# EAGLE design DAI_V1.1 (EAGLE 9.6.2)

## Sheet 1 of 2
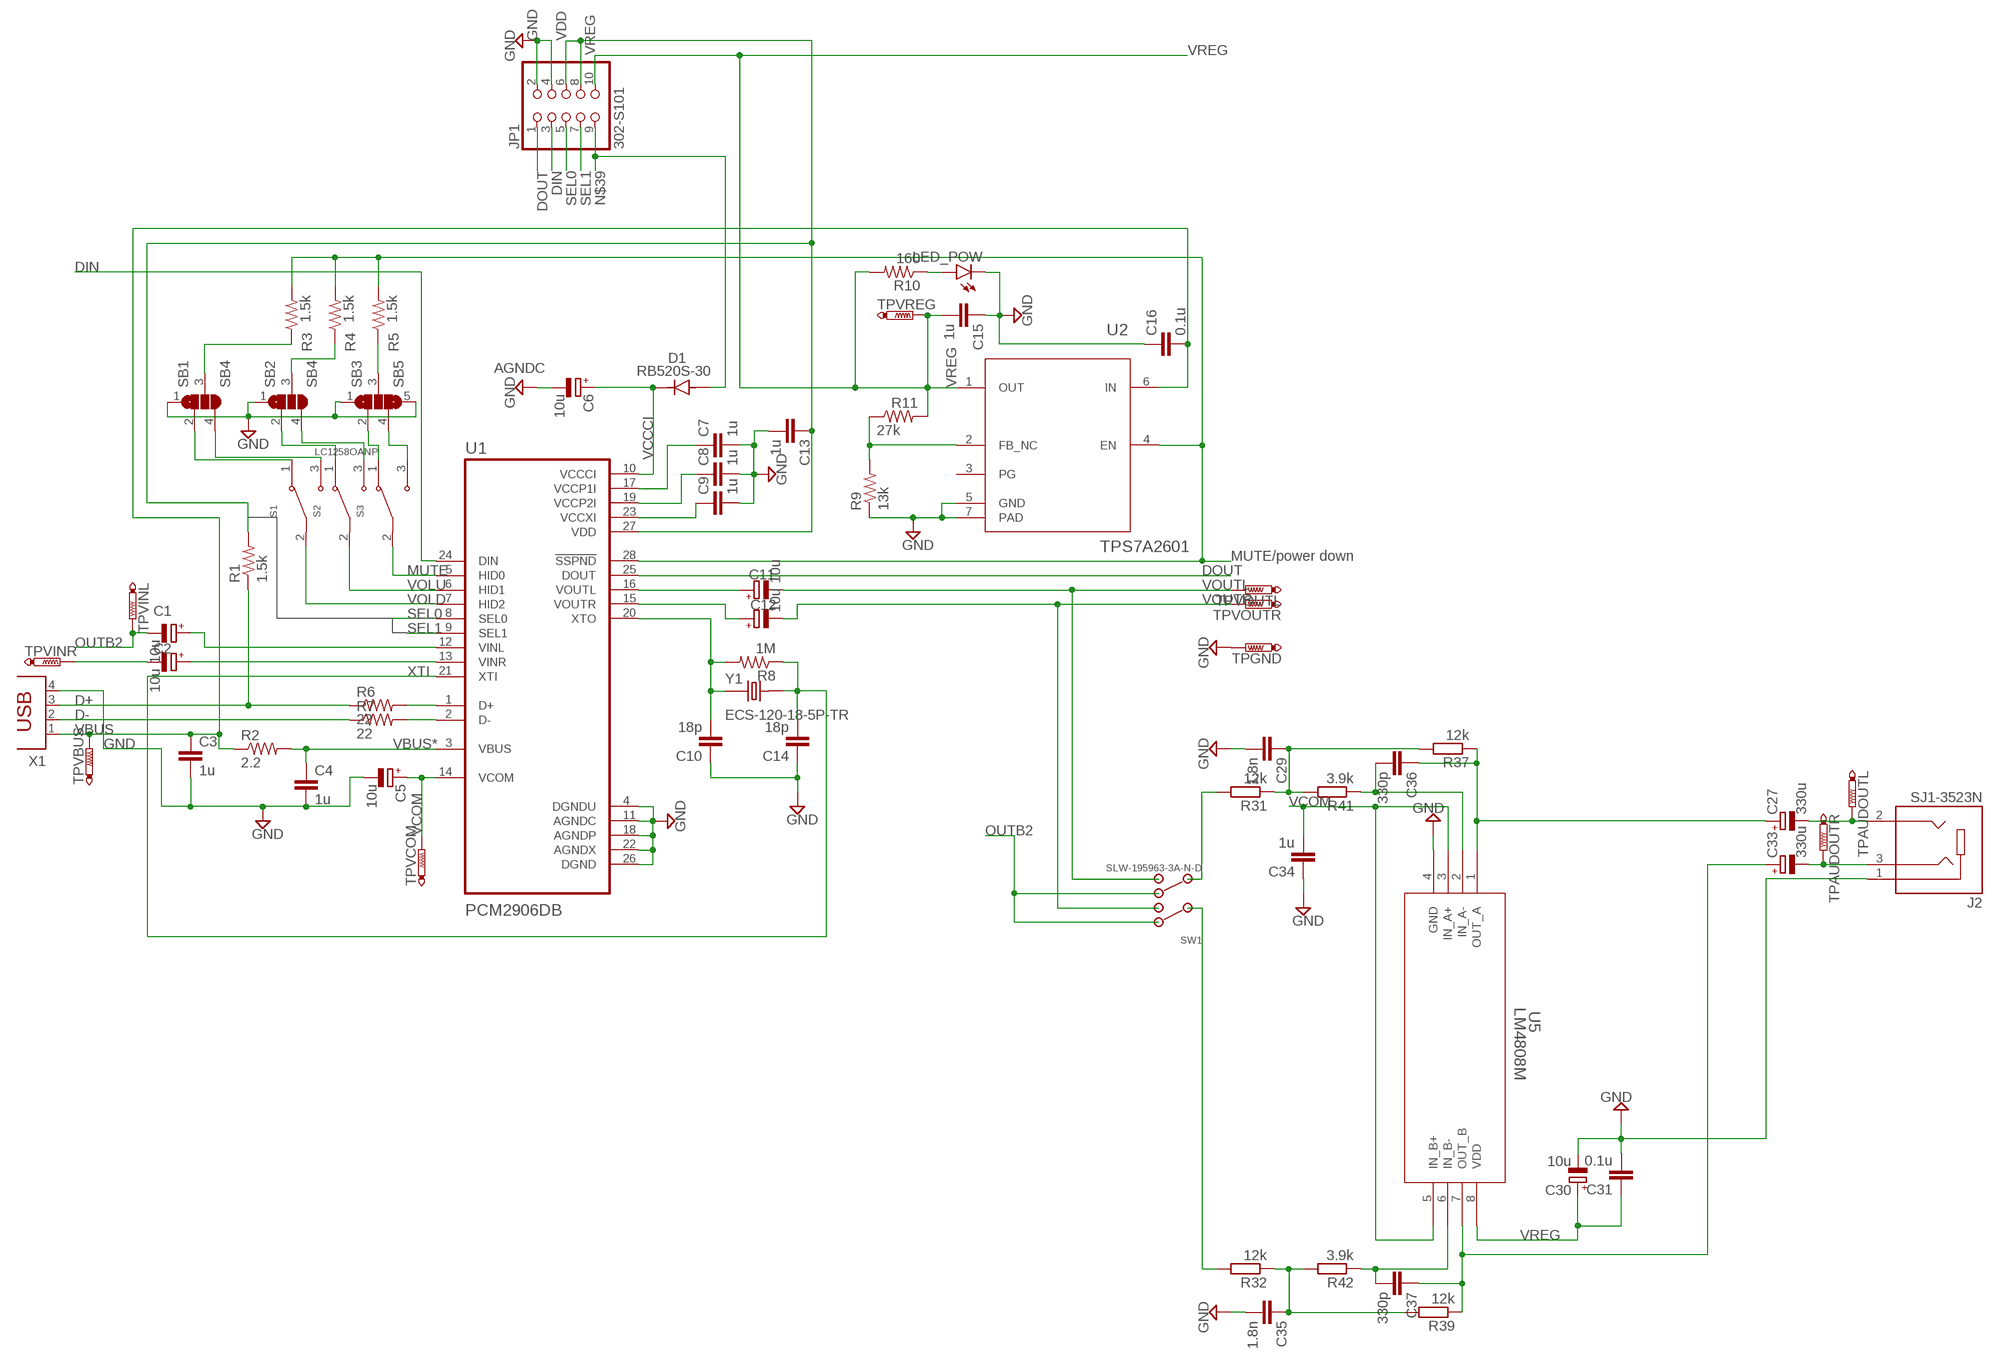
[diagram p0: schematic, sheet 1]

### Parts
C1  10u  CPOL-EUD  [PANASONIC_D]
C2  10u  CPOL-EUD  [PANASONIC_D]
C3  1u  C-EUC0805  [C0805]
C4  1u  C-EUC0805  [C0805]
C5  10u  CPOL-EUB  [PANASONIC_B]
C6  10u  CPOL-EUB  [PANASONIC_B]
C7  1u  C-EUC0805  [C0805]
C8  1u  C-EUC0805  [C0805]
C9  1u  C-EUC0805  [C0805]
C10  18p  C-EUC0805  [C0805]
C11  10u  CPOL-EUD  [PANASONIC_D]
C12  10u  CPOL-EUD  [PANASONIC_D]
C13  1u  C-EUC0805  [C0805]
C14  18p  C-EUC0805  [C0805]
C15  1u  C-EUC0805  [C0805]
C16  0.1u  C-EUC0805  [C0805]
C27  330u  CPOL-EUE3.5-10  [E3,5-10]
C29  1.8n  C-EUC1206  [C1206]
C30  10u  CPOL-EUB  [PANASONIC_B]
C31  0.1u  C-EUC0805  [C0805]
C33  330u  CPOL-EUE3.5-10  [E3,5-10]
C34  1u  C-EUC0805  [C0805]
C35  1.8n  C-EUC1206  [C1206]
C36  330p  C-EUC1206  [C1206]
C37  330p  C-EUC1206  [C1206]
D1  RB520S-30  [DIO_RB520S-30]
J2  SJ1-3523N  [CUI_SJ1-3523N]
JP1  302-S101  PINHD-2X5  [2X05]
LED_POW  LED5MM  [LED5MM]
R1  1.5k  R-US_R0805  [R0805]
R2  2.2  R-US_R0805  [R0805]
R3  1.5k  R-US_R0805  [R0805]
R4  1.5k  R-US_R0805  [R0805]
R5  1.5k  R-US_R0805  [R0805]
R6  22  R-US_R0805  [R0805]
R7  22  R-US_R0805  [R0805]
R8  1M  R-US_R0805  [R0805]
R9  13k  R-US_R0805  [R0805]
R10  160  R-US_R0805  [R0805]
R11  27k  R-US_R0805  [R0805]
R31  12k  R-EU_M1206  [M1206]
R32  12k  R-EU_M1206  [M1206]
R37  12k  R-EU_M1206  [M1206]
R39  12k  R-EU_M1206  [M1206]
R41  3.9k  R-EU_M1206  [M1206]
R42  3.9k  R-EU_M1206  [M1206]
S1  LC1258EENP  [SW_LC1258EENP]
S2  LC1258OANP  LC1258EENP  [SW_LC1258EENP]
S3  LC1258EENP  [SW_LC1258EENP]
SB1  SB4  [SB4]
SB2  SB4  [SB4]
SB3  SB5  [SB5]
SW1  SLW-195963-3A-N-D  SW-T3-4B-A-A3-S2  [SW-T3-4B-A-A3-S2]
TPAUDOUTL  PTR1PAD1-13  [P1-13]
TPAUDOUTR  PTR1PAD1-13  [P1-13]
TPGND  PTR1PAD1-13  [P1-13]
TPVBUS  PTR1PAD1-13  [P1-13]
TPVCOM  PTR1PAD1-13  [P1-13]
TPVINL  PTR1PAD1-13  [P1-13]
TPVINR  PTR1PAD1-13  [P1-13]
TPVOUTL  PTR1PAD1-13  [P1-13]
TPVOUTR  PTR1PAD1-13  [P1-13]
TPVREG  PTR1PAD1-13  [P1-13]
U1  PCM2906DB  [SOP65P780X200-28N]
U2  TPS7A2601  TPS7A2601DRVRDRV0006A_NV  [DRV0006A_NV]
U5  LM4808M  LM4808M/NOPB  [M08A]
X1  PN61729  [PN61729]
Y1  ECS-120-18-5P-TR  [XTAL_ECS-120-18-5P-TR]

### Nets
AUDOUTL: C27.- J2.2 TPAUDOUTL.TP
AUDOUTR: C33.- J2.3 TPAUDOUTR.TP
D+: R1.1 R6.1 X1.3
D-: R7.1 X1.2
DIN: JP1.3 U1.24(DIN)
DOUT: JP1.1 U1.25(DOUT)
GND: C3.2 C4.2 C5.- C6.- C7.2 C8.2 C9.2 C10.1 C13.2 C14.1 C15.1 C16.1 C29.2 C30.- C31.2 C34.1 C35.2 J2.1 JP1.2 JP1.4 LED_POW.K(C) R9.1 SB1.1 SB2.1 SB3.1 SB3.5 TPGND.TP U1.4(DGNDU) U1.11(AGNDC) U1.18(AGNDP) U1.22(AGNDX) U1.26(DGND) U2.5(GND) U2.7(PAD) U5.4(GND) X1.4 ; also sheet 2
MUTE: S3.2(COM) U1.5(HID0)
N$1: R6.2 U1.1(D+)
N$2: R7.2 U1.2(D-)
N$3: R32.2 SW1.2
N$6: R3.1 SB1.3
N$7: C29.1 R31.1 R37.2 R41.2
N$8: R5.1 SB3.3
N$10: LED_POW.A R10.1
N$11: C35.1 R32.1 R39.2 R42.2
N$12: C33.+ C37.1 R39.1 U5.7(OUT_B)
N$13: R4.1 SB2.3
N$14: S1.1(NC) SB1.2
N$15: R9.2 R11.1 U2.2(FB_NC)
N$18: C11.+ U1.16(VOUTL)
N$19: C12.+ U1.15(VOUTR)
N$20: S1.3(NO) SB1.4
N$21: S2.1(NC) SB2.2
N$22: S2.3(NO) SB2.4
N$23: S3.1(NC) SB3.2
N$24: S3.3(NO) SB3.4
N$30: C36.2 R41.1 U5.2(IN_A-)
N$34: R31.2 SW1.5
N$35: C27.+ C36.1 R37.1 U5.1(OUT_A)
N$39: D1.A JP1.9
N$40: C37.2 R42.1 U5.6(IN_B-)
OUTB2: C1.- SW1.1 SW1.4 TPVINL.TP ; also sheet 2
SEL0: JP1.5 U1.8(SEL0)
SEL1: JP1.7 U1.9(SEL1)
SSPND: R3.2 R4.2 R5.2 U1.28(!SSPND) U2.4(EN)
VBUS: C3.1 C16.2 R2.1 TPVBUS.TP U2.6(IN) X1.1
VBUS*: C4.1 R2.2 U1.3(VBUS)
VCCCI: C6.+ D1.C(K) U1.10(VCCCI)
VCCP1I: C7.1 U1.17(VCCP1I)
VCCP2I: C8.1 U1.19(VCCP2I)
VCCXI: C9.1 U1.23(VCCXI)
VCOM: C5.+ C34.2 TPVCOM.TP U1.14(VCOM) U5.3(IN_A+) U5.5(IN_B+) ; also sheet 2
VDD: C13.1 JP1.6 JP1.8 R1.2 U1.27(VDD)
VINL: C1.+ U1.12(VINL)
VINR: C2.- TPVINR.TP
VINR*: C2.+ U1.13(VINR)
VOLD: S1.2(COM) U1.7(HID2)
VOLU: S2.2(COM) U1.6(HID1)
VOUTL: C11.- SW1.6 TPVOUTL.TP
VOUTR: C12.- SW1.3 TPVOUTR.TP
VREG: C15.2 C30.+ C31.1 JP1.10 R10.2 R11.2 TPVREG.TP U2.1(OUT) U5.8(VDD) ; also sheet 2
XTI: C14.2 R8.1 U1.21(XTI) Y1.2
XTO: C10.2 R8.2 U1.20(XTO) Y1.1
Unconnected: U2.3(PG)

### Notes on the sheet
- AGNDC
- MUTE/power down

## Sheet 2 of 2
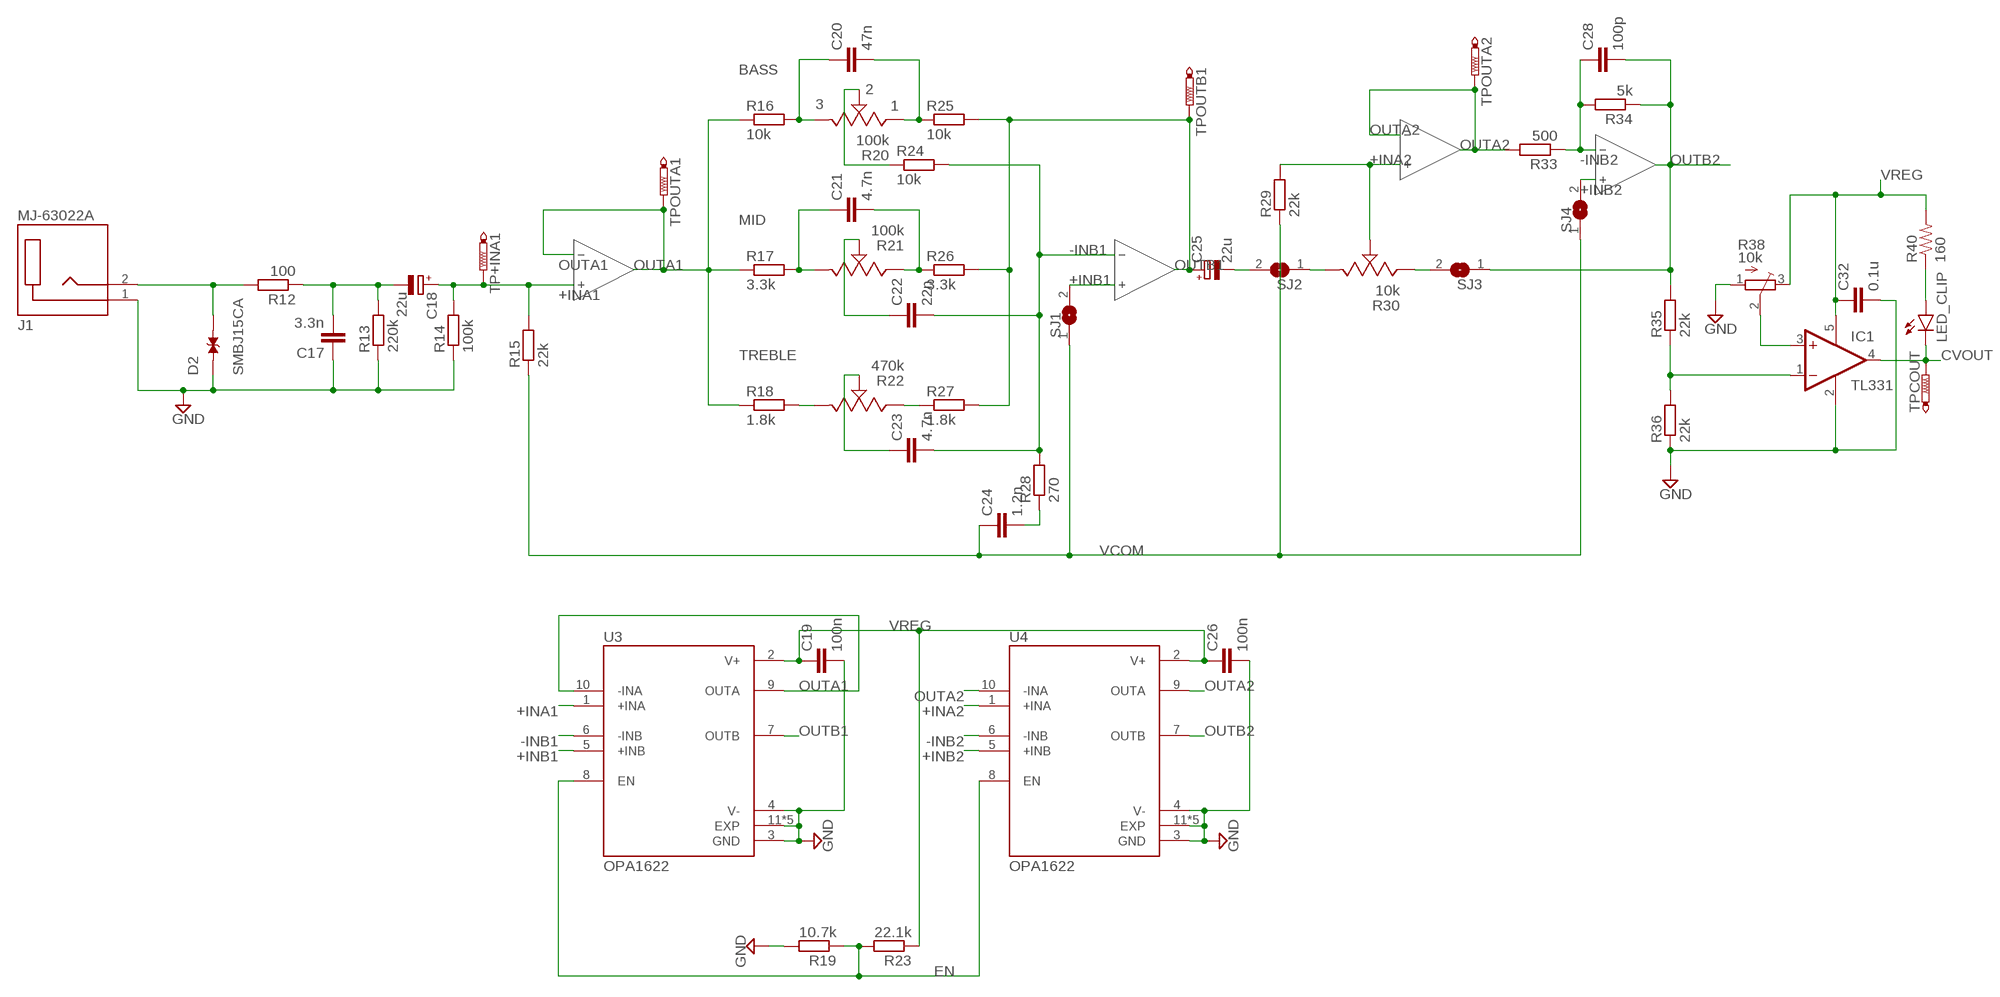
[diagram p1: schematic, sheet 2]

### Parts
C17  3.3n  C-EUC1206  [C1206]
C18  22u  CPOL-EUD  [PANASONIC_D]
C19  100n  C-EUC0805  [C0805]
C20  47n  C-EUC1206  [C1206]
C21  4.7n  C-EUC1206  [C1206]
C22  22n  C-EUC1206  [C1206]
C23  4.7n  C-EUC1206  [C1206]
C24  1.2n  C-EUC1206  [C1206]
C25  22u  CPOL-EUD  [PANASONIC_D]
C26  100n  C-EUC0805  [C0805]
C28  100p  C-EUC1206  [C1206]
C32  0.1u  C-EUC0805  [C0805]
D2  SMBJ15CA  [DIOM4336X265N]
IC1  TL331  [DBV-R-PDSO-G5]
J1  MJ-63022A  [CUI_MJ-63022A]
LED_CLIP  LED5MM  [LED5MM]
R12  100  R-EU_M1206  [M1206]
R13  220k  R-EU_M1206  [M1206]
R14  100k  R-EU_M1206  [M1206]
R15  22k  R-EU_M1206  [M1206]
R16  10k  R-EU_M1206  [M1206]
R17  3.3k  R-EU_M1206  [M1206]
R18  1.8k  R-EU_M1206  [M1206]
R19  10.7k  R-EU_R1206  [R1206]
R20  100k  PTN16-A100125K1B1  [POT_PTN16-A100125K1B1]
R21  100k  PTN16-A100125K1B1  [POT_PTN16-A100125K1B1]
R22  470k  PTN16-A100125K1B1  [POT_PTN16-A100125K1B1]
R23  22.1k  R-EU_R1206  [R1206]
R24  10k  R-EU_M1206  [M1206]
R25  10k  R-EU_M1206  [M1206]
R26  3.3k  R-EU_M1206  [M1206]
R27  1.8k  R-EU_M1206  [M1206]
R28  270  R-EU_M1206  [M1206]
R29  22k  R-EU_M1206  [M1206]
R30  10k  PTN16-A100125K1B1  [POT_PTN16-A100125K1B1]
R33  500  R-EU_M1206  [M1206]
R34  5k  R-EU_M1206  [M1206]
R35  22k  R-EU_M1206  [M1206]
R36  22k  R-EU_M1206  [M1206]
R38  10k  601030  [601030_AVX]
R40  160  R-US_R0805  [R0805]
SJ1  SJW  [SJW]
SJ2  SJW  [SJW]
SJ3  SJW  [SJW]
SJ4  SJW  [SJW]
TP+INA1  PTR1PAD1-13  [P1-13]
TPCOUT  PTR1PAD1-13  [P1-13]
TPOUTA1  PTR1PAD1-13  [P1-13]
TPOUTA2  PTR1PAD1-13  [P1-13]
TPOUTB1  PTR1PAD1-13  [P1-13]
U3  OPA1622  OPA1622IDRCR  [IC_OPA1622IDRCR]
U4  OPA1622  OPA1622IDRCR  [IC_OPA1622IDRCR]

### Nets
+INA1: C18.+ R14.2 R15.2 TP+INA1.TP U3.1(+INA)
+INA2: R29.2 R30.2 U4.1(+INA)
+INB1: SJ1.2 U3.5(+INB)
+INB2: SJ4.2 U4.5(+INB)
-INB1: C22.2 C23.2 R24.2 R28.2 U3.6(-INB)
-INB2: C28.1 R33.1 R34.2 U4.6(-INB)
CVOUT: IC1.4(OUT) LED_CLIP.K(C) TPCOUT.TP
EN: R19.1 R23.2 U3.8(EN) U4.8(EN)
GND: C17.1 C19.2 C26.2 C32.2 D2.1 IC1.2(GND) J1.1(SLEEVE) R13.1 R14.1 R19.2 R36.1 R38.1(A) U3.3(GND) U3.4(V-) U3.11(EXP) U3.12(EXP) U3.13(EXP) U3.14(EXP) U3.15(EXP) U4.3(GND) U4.4(V-) U4.11(EXP) U4.12(EXP) U4.13(EXP) U4.14(EXP) U4.15(EXP) ; also sheet 1
N$4: R18.2 R22.3
N$5: R22.1 R27.1
N$9: C25.- SJ2.2
N$16: D2.2 J1.2(TIP) R12.2
N$17: C17.2 C18.- R12.1 R13.2
N$25: C21.1 R17.2 R21.3
N$26: C21.2 R21.1 R26.1
N$27: R30.3 SJ2.1
N$28: C20.1 R16.2 R20.3
N$29: IC1.1(-IN) R35.1 R36.2
N$31: C20.2 R20.1 R25.1
N$32: R20.2 R24.1
N$33: R30.1 SJ3.2
N$36: C23.1 R22.2
N$37: C22.1 R21.2
N$38: IC1.3(+IN) R38.2(S)
N$42: LED_CLIP.A R40.1
N$45: C24.2 R28.1
OUTA1: R16.1 R17.1 R18.1 TPOUTA1.TP U3.9(OUTA) U3.10(-INA)
OUTA2: R33.2 TPOUTA2.TP U4.9(OUTA) U4.10(-INA)
OUTB1: C25.+ R25.2 R26.2 R27.2 TPOUTB1.TP U3.7(OUTB)
OUTB2: C28.2 R34.1 R35.2 SJ3.1 U4.7(OUTB) ; also sheet 1
VCOM: C24.1 R15.1 R29.1 SJ1.1 SJ4.1 ; also sheet 1
VREG: C19.1 C26.1 C32.1 IC1.5(V+) R23.1 R38.3(E) R40.2 U3.2(V+) U4.2(V+) ; also sheet 1

### Notes on the sheet
- BASS
- 2
- 3 | 1
- MID
- TREBLE

## Library data of the parts
C1 C2 C5 C6 C11 C12 C18 C25 C27 C30 C33 = rcl:CPOL-EU: POLARIZED CAPACITOR, European symbol; SPICEPREFIX: C
C3 C4 C7-C10 C13-C17 C19-C24 C26 C28 C29 C31 C32 C34-C37 = rcl:C-EU: CAPACITOR, European symbol; SPICEPREFIX: C
D1 = RB520S-30:RB520S-30: Check availability <https://pricing.snapeda.com/parts/RB520S-30/Taiwan%20Semiconductor/view-part?ref=eda>; AVAILABILITY: In Stock; CHECK_PRICES: https://www.snapeda.com/parts/RB520S-30/taiwan/view-part/?ref=eda; DESCRIPTION: Diode Small Signal Schottky 30V 0.2A 2-Pin SOD-523F T/R; MF: Taiwan Semiconductor; MP: RB520S-30; PACKAGE: SOD-523F-2 Taiwan Semiconductor; PRICE: None; SNAPEDA_LINK: https://www.snapeda.com/parts/RB520S-30/taiwan/view-part/?ref=snap
D2 = SMBJ15CA:SMBJ15CA: Check availability <https://pricing.snapeda.com/parts/SMBJ15CA/Taiwan%20Semiconductor/view-part?ref=eda>; AVAILABILITY: In Stock; CHECK_PRICES: https://www.snapeda.com/parts/SMBJ15CA/taiwan/view-part/?ref=eda; DESCRIPTION: 600W, 17.6V, 5%, Bidirectional, TVS; MF: Taiwan Semiconductor; MP: SMBJ15CA; PACKAGE: SMB Taiwan Semiconductor; PRICE: None; SNAPEDA_LINK: https://www.snapeda.com/parts/SMBJ15CA/taiwan/view-part/?ref=snap
IC1 = linear:TL331: SINGLE DIFFERENTIAL COMPARATOR Source: Data sheet <http://www.ti.com/lit/ds/symlink/tl331-q1.pdf>
J1 = MJ-63022A:MJ-63022A: Check availability <https://pricing.snapeda.com/parts/MJ-63022A/Same%20Sky/view-part?ref=eda>; AVAILABILITY: In Stock; CHECK_PRICES: https://www.snapeda.com/parts/MJ-63022A/Same+Sky/view-part/?ref=eda; DESCRIPTION: 6.35 mm, Mono, Right Angle, Through Hole Mount, 2 Conductors, 0 Internal Switches, Audio Jack Connector; MF: Same Sky; MP: MJ-63022A; PACKAGE: None; PRICE: None; SNAPEDA_LINK: https://www.snapeda.com/parts/MJ-63022A/Same+Sky/view-part/?ref=snap
J2 = SJ1-3523N:SJ1-3523N: Check availability <https://pricing.snapeda.com/parts/SJ1-3523N/Same%20Sky/view-part?ref=eda>; AVAILABILITY: In Stock; CHECK_PRICES: https://www.snapeda.com/parts/SJ1-3523N/Same+Sky/view-part/?ref=eda; DESCRIPTION: 3.5 mm, Stereo, Right Angle, Through Hole, 3 Conductors, 0 Internal Switches, Audio Jack Connector; MF: Same Sky; MP: SJ1-3523N; PACKAGE: None; PRICE: None; SNAPEDA_LINK: https://www.snapeda.com/parts/SJ1-3523N/Same+Sky/view-part/?ref=snap
JP1 = pinhead:PINHD-2X5: PIN HEADER
LED_CLIP LED_POW = led:LED: LED OSRAM: - CHIPLED LG R971, LG N971, LY N971, LG Q971, LY Q971, LO R971, LY R971 LH N974, LH R974 LS Q976, LO Q976, LY Q976 LO Q996 - Hyper CHIPLED LW Q18S LB Q993, LB Q99A, LB R99A - SideLED LS A670, LO A670, LY A670, LG A670, LP A670 LB A673, LV A673, LT A673, LW A673 LH A674 LY A675 LS A676, LA A676, LO A676, LY A676, LW A676 LS A679, LY A679, LG A679 - Hyper Micro SIDELED® LS Y876, LA Y876, LO Y876, LY Y876 LT Y87S - SmartLED LW L88C, LW L88S LB L89C, LB L89S, LG L890 LS L89K, LO L89K, LY L89K LS L896, LA L896, LO L896, LY L896 - TOPLED LS T670, LO T670, LY T670, LG T670, LP T670 LSG T670, LSP T670, LSY T670, LOP T670, LYG T670 LG T671, LOG T671, LSG T671 LB T673, LV T673, LT T673, LW T673 LH T674 LS T676, LA T676, LO T676, LY T676, LB T676, LH T676, LSB T676, LW T676 LB T67C, LV T67C, LT T67C, LS T67K, LO T67K, LY T67K, LW E67C LS E67B, LA E67B, LO E67B, LY E67B, LB E67C, LV E67C, LT E67C LW T67C LS T679, LY T679, LG T679 LS T770, LO T770, LY T770, LG T770, LP T770 LB T773, LV T773, LT T773, LW T773 LH T774 LS E675, LA E675, LY E675, LS T675 LS T776, LA T776, LO T776, LY T776, LB T776 LHGB T686 LT T68C, LB T68C - Hyper Mini TOPLED® LB M676 - Mini TOPLED Santana® LG M470 LS M47K, LO M47K, LY M47K Source: http://www.osram.convergy.de LUXEON: - LUMILED® LXK2-PW12-R00, LXK2-PW12-S00, LXK2-PW14-U00, LXK2-PW14-V00 LXK2-PM12-R00, LXK2-PM12-S00, LXK2-PM14-U00 LXK2-PE12-Q00, LXK2-PE12-R00, LXK2-PE12-S00, LXK2-PE14-T00, LXK2-PE14-U00 LXK2-PB12-K00, LXK2-PB12-L00, LXK2-PB12-M00, LXK2-PB14-N00, LXK2-PB14-P00, LXK2-PB14-Q00 LXK2-PR12-L00, LXK2-PR12-M00, LXK2-PR14-Q00, LXK2-PR14-R00 LXK2-PD12-Q00, LXK2-PD12-R00, LXK2-PD12-S00 LXK2-PH12-R00, LXK2-PH12-S00 LXK2-PL12-P00, LXK2-PL12-Q00, LXK2-PL12-R00 Source: www.luxeon.com KINGBRIGHT: KA-3528ASYC Source: www.kingbright.com
R1-R11 R40 = rcl:R-US_: RESISTOR, American symbol; SPICEPREFIX: R
R12-R19 R23-R29 R31-R37 R39 R41 R42 = rcl:R-EU_: RESISTOR, European symbol; SPICEPREFIX: R
R20-R22 R30 = PTN16-A100125K1B1:PTN16-A100125K1B1: Check availability <https://pricing.snapeda.com/parts/PTN16-A100125K1B1/Same%20Sky/view-part?ref=eda>; AVAILABILITY: In Stock; CHECK_PRICES: https://www.snapeda.com/parts/PTN16-A100125K1B1/Same+Sky/view-part/?ref=eda; DESCRIPTION: 16.5 mm, Horizontal, Linear, 100 kΩ, Through Hole, Knurled Shaft Single Section Rotary Potentiometer; MF: Same Sky; MP: PTN16-A100125K1B1; PACKAGE: Package; PRICE: None; SNAPEDA_LINK: https://www.snapeda.com/parts/PTN16-A100125K1B1/Same+Sky/view-part/?ref=snap
R38 = 601030:601030; COPYRIGHT: Copyright (C) 2025 Ultra Librarian. All rights reserved.; MANUFACTURER_NAME: KYOCERA AVX; MANUFACTURER_PART_NUMBER: 601030
S1-S3 = LC1258EENP:LC1258EENP: Check availability <https://pricing.snapeda.com/parts/LC1258EENP/E-Switch/view-part?ref=eda>; AVAILABILITY: In Stock; CHECK_PRICES: https://www.snapeda.com/parts/LC1258EENP/E-Switch/view-part/?ref=eda; DESCRIPTION: SWITCH PUSHBUTTON SPDT 0.3A 30V; MF: E-Switch; MP: LC1258EENP; PACKAGE: None; PRICE: None; SNAPEDA_LINK: https://www.snapeda.com/parts/LC1258EENP/E-Switch/view-part/?ref=snap
SB1 SB2 = SB:SB4
SB3 = SB:SB5
SJ1-SJ4 = jumper:SJ: SMD solder JUMPER
SW1 = SW-T3-4B-A-A3-S2:SW-T3-4B-A-A3-S2
TP+INA1 TPAUDOUTL TPAUDOUTR TPCOUT TPGND TPOUTA1 TPOUTA2 TPOUTB1 TPVBUS TPVCOM TPVINL TPVINR TPVOUTL TPVOUTR TPVREG = testpad:PTR1: TEST PIN
U1 = PCM2906DB:PCM2906DB: Check availability <https://pricing.snapeda.com/parts/PCM2906DB/Texas%20Instruments/view-part?ref=eda>; AVAILABILITY: In Stock; CHECK_PRICES: https://www.snapeda.com/parts/PCM2906DB/Texas+Instruments/view-part/?ref=eda; DESCRIPTION: Stereo USB1.1 CODEC with line-out and S/PDIF I/O, Bus-powered (HID Interface + 500mA USB Current) 28-SSOP; MF: Texas Instruments; MP: PCM2906DB; PACKAGE: SSOP-28 Texas Instruments; PRICE: None; SNAPEDA_LINK: https://www.snapeda.com/parts/PCM2906DB/Texas+Instruments/view-part/?ref=snap
U2 = TPS7A2601DRVR:TPS7A2601DRVR; COPYRIGHT: Copyright (C) 2025 Ultra Librarian. All rights reserved.; DATASHEET: https://www.ti.com/lit/gpn/tps7a26; DESCRIPTION: 500-mA, 18-V, ultra-low-IQ, high-accuracy, adjustable low-dropout voltage regulator with power good 6-WSON -40 to 125; MANUFACTURER_NAME: Texas Instruments; MANUFACTURER_PART_NUMBER: TPS7A2601DRVR; REFDES: RefDes; TYPE: TYPE
U3 U4 = OPA1622IDRCR:OPA1622IDRCR: Check availability <https://pricing.snapeda.com/parts/OPA1622IDRCR/Texas%20Instruments/view-part?ref=eda>; AVAILABILITY: In Stock; CHECK_PRICES: https://www.snapeda.com/parts/OPA1622IDRCR/Texas+Instruments/view-part/?ref=eda; DESCRIPTION: SoundPlus™ Audio Operational Amplifier with High Performance, Low THD+N and Bipolar Input; MF: Texas Instruments; MP: OPA1622IDRCR; PACKAGE: VSON-10 Texas Instruments; PRICE: None; SNAPEDA_LINK: https://www.snapeda.com/parts/OPA1622IDRCR/Texas+Instruments/view-part/?ref=snap
U5 = LM4808M:LM4808M/NOPB; COPYRIGHT: Copyright (C) 2025 Ultra Librarian. All rights reserved.; DATASHEET: https://www.ti.com/lit/gpn/lm4808; DESCRIPTION: 105-mW, stereo, analog input headphone amplifier 8-SOIC -40 to 85; MANUFACTURER_NAME: Texas Instruments; MANUFACTURER_PART_NUMBER: LM4808M/NOPB
X1 = con-berg:PN61729: BERG USB connector; OC_FARNELL: unknown; OC_NEWARK: unknown
Y1 = ECS-120-18-5P-TR:ECS-120-18-5P-TR: Check availability <https://pricing.snapeda.com/parts/ECS-120-18-5P-TR/ECS%20International/view-part?ref=eda>; AVAILABILITY: In Stock; CHECK_PRICES: https://www.snapeda.com/parts/ECS-120-18-5P-TR/ECS/view-part/?ref=eda; DESCRIPTION: 12 MHz ±30ppm Crystal 18pF 50 Ohms HC-49/US; MF: ECS International; MP: ECS-120-18-5P-TR; PACKAGE: HC49/US ECS International; PRICE: None; SNAPEDA_LINK: https://www.snapeda.com/parts/ECS-120-18-5P-TR/ECS/view-part/?ref=snap

## Board
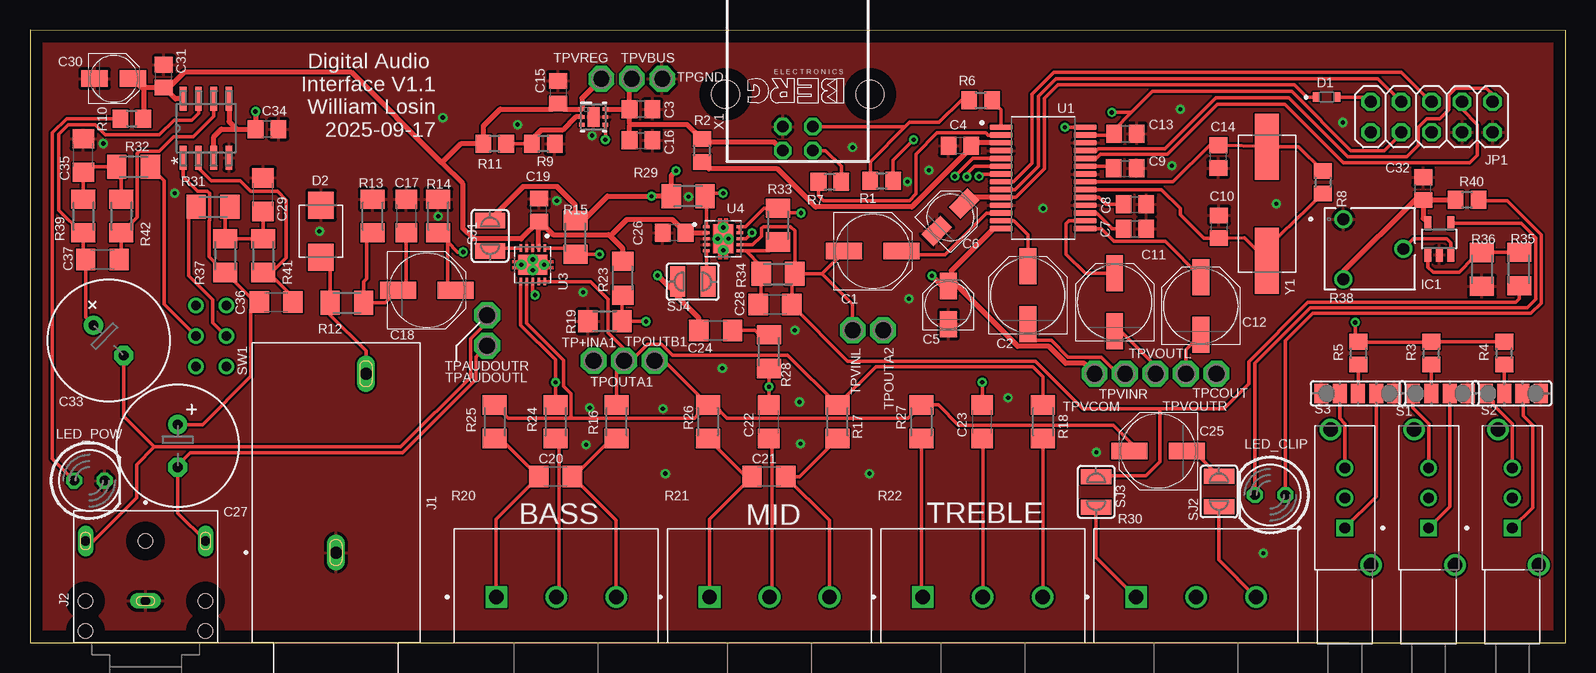
[diagram p2: board, top side]
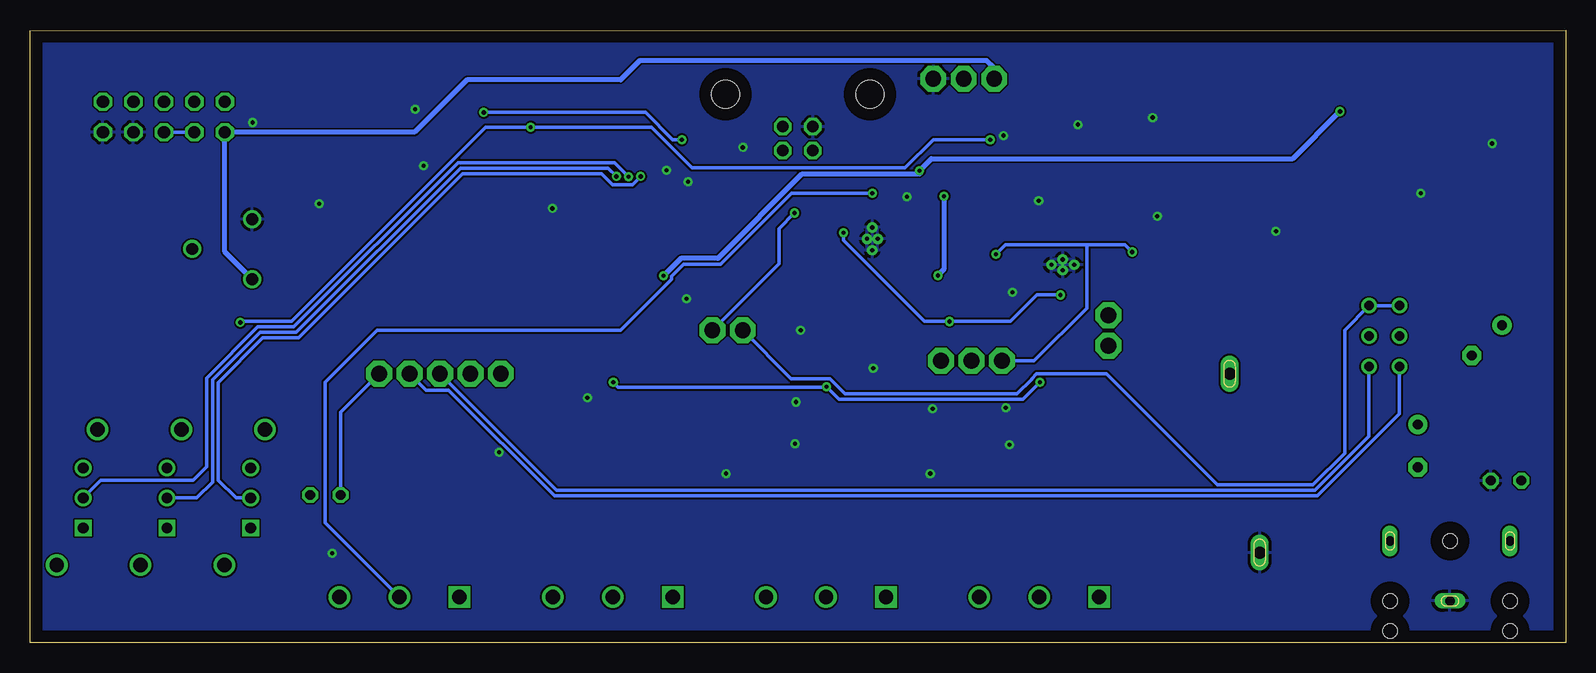
[diagram p3: board, bottom side, seen from below]

Size 128 x 51.06 mm. Coordinates in mm from the lower left corner, seen from the top.
Outline: 0,0 128,0 128,51 0,51.06 0,0
Copper layers (1*16): Top 0.035mm / dielectric 1.5mm / Bottom 0.035mm
Design rules "default": minimum track width 6mil, minimum drill 0.35mm, track to track 6mil, track to pad 6mil, pad to pad 6mil, via to via 6mil, smd to smd 6mil, copper to edge 40mil, drill to drill 6mil, minimum pad ring 10mil, minimum via ring 8mil, stop-mask expansion 4mil, vias tented up to drill 0mil, thermal gap 10mil

### Footprints (pad centres in the part's own frame; a part is rotated, then mirrored left to right if it is on the bottom)
PANASONIC_D = smd 3 x 1.4: + 2.4,0; - -2.4,0
C0805 = smd 1.3 x 1.5: 1 -0.95,0; 2 0.95,0
PANASONIC_B = smd 2.2 x 1.4: + 1.6,0; - -1.6,0
C1206 = smd 1.6 x 1.8: 1 -1.4,0; 2 1.4,0
E3,5-10 = drill 0.813 pad 1.6: + -1.778,0 | drill 0.813 pad 1.6 octagon: - 1.778,0
DIO_RB520S-30 = smd 0.6 x 0.8: A 0.85,0; C -0.85,0
DIOM4336X265N = smd 2.28 x 2.12: 1 -2.165,0; 2 2.165,0
DBV-R-PDSO-G5 = smd 0.6 x 1.2: 1 -0.95,-1.306; 2 0,-1.306; 3 0.95,-1.306; 4 0.95,1.306; 5 -0.95,1.306
CUI_MJ-63022A = drill 1 long: 1 0,0; 2 14.9,-2.5
CUI_SJ1-3523N = drill 0.8 long: 1 0,0; 2 5,5; 3 -5,5 | hole 1.2: -5,-2.5; -5,0; 0,5; 5,-2.5; 5,0
2X05 = drill 1.016 octagon: 1 -5.08,-1.27; 2 -5.08,1.27; 3 -2.54,-1.27; 4 -2.54,1.27; 5 0,-1.27; 6 0,1.27; 7 2.54,-1.27; 8 2.54,1.27; 9 5.08,-1.27; 10 5.08,1.27
LED5MM = drill 0.813 octagon: A -1.27,0; K 1.27,0
R0805 = smd 1.3 x 1.5: 1 -0.95,0; 2 0.95,0
M1206 = smd 1.6 x 2: 1 -1.4,0; 2 1.4,0
R1206 = smd 1.6 x 1.803: 1 -1.422,0; 2 1.422,0
POT_PTN16-A100125K1B1 = drill 1.2 square: 1 0,0 | drill 1.2: 2 5,0; 3 10,0
601030_AVX = drill 0.991 pad 1.499: 1 -2.54,-2.54; 2 -0.051,2.464; 3 2.464,-2.54
SW_LC1258EENP = drill 0.9 square: 1 2.5,0 | drill 0.9: 2 0,0; 3 -2.5,0 | drill 1.2: SH1 5.6,2.2; SH2 -5.7,-1.2
SB4 = smd 1.168 x 1.6: 1 -1.524,0; 2 0,0; 3 1.524,0; 4 3.048,0
SB5 = smd 1.168 x 1.6: 1 -3.048,0; 2 -1.524,0; 3 0,0; 4 1.524,0; 5 3.048,0
SJW = smd 1.27 x 2.54: 1 -1.27,0; 2 1.27,0
SW-T3-4B-A-A3-S2 = drill 0.787: 1 -1.27,-1.27; 2 1.27,-1.27; 3 3.81,-1.27; 4 -1.27,1.27; 5 1.27,1.27; 6 3.81,1.27
P1-13 = drill 1.321 pad 2.159 octagon: TP 0,0
SOP65P780X200-28N = smd 1.9 x 0.48: 1 -3.505,4.225; 2 -3.505,3.575; 3 -3.505,2.925; 4 -3.505,2.275; 5 -3.505,1.625; 6 -3.505,0.975; 7 -3.505,0.325; 8 -3.505,-0.325; 9 -3.505,-0.975; 10 -3.505,-1.625; 11 -3.505,-2.275; 12 -3.505,-2.925; 13 -3.505,-3.575; 14 -3.505,-4.225; 15 3.505,-4.225; 16 3.505,-3.575; 17 3.505,-2.925; 18 3.505,-2.275; 19 3.505,-1.625; 20 3.505,-0.975; 21 3.505,-0.325; 22 3.505,0.325; 23 3.505,0.975; 24 3.505,1.625; 25 3.505,2.275; 26 3.505,2.925; 27 3.505,3.575; 28 3.505,4.225
DRV0006A_NV = smd 0.45 x 0.3: 1 -0.975,0.65; 2 -0.975,0; 3 -0.975,-0.65; 4 0.975,-0.65; 5 0.975,0; 6 0.975,0.65 | smd 1 x 1.6: 7 0,0
IC_OPA1622IDRCR = smd 0.6 x 0.24: 1 -1.4,1; 2 -1.4,0.5; 3 -1.4,0; 4 -1.4,-0.5; 5 -1.4,-1; 6 1.4,-1; 7 1.4,-0.5; 8 1.4,0; 9 1.4,0.5; 10 1.4,1 | smd 1.65 x 2.4: 11 0,0 | drill 0.35: 12 0,0.95; 13 -0.448,0; 14 0.448,0; 15 0,-0.95
M08A = smd 1.981 x 0.559: 1 -2.464,1.905; 2 -2.464,0.635; 3 -2.464,-0.635; 4 -2.464,-1.905; 5 2.464,-1.905; 6 2.464,-0.635; 7 2.464,0.635; 8 2.464,1.905
PN61729 = drill 0.95 octagon: 1 1.25,4.71; 2 -1.25,4.71; 3 -1.25,2.71; 4 1.25,2.71 | hole 2.3: -6.02,0; 6.02,0
XTAL_ECS-120-18-5P-TR = smd 5.5 x 2: 1 -4.75,0; 2 4.75,0

### Placement (x,y rotation side)
C1  70.26,32.64 0 top
C2  83.19,28.96 90 top
C3  50.93,41.86 0 top
C4  77.52,41.43 180 top
C5  76.56,28.14 90 top
C6  76.73,35.46 45 top
C7  92.1,34.49 0 top
C8  92.1,36.53 0 top
C9  91.29,39.52 0 top
C10  99.11,34.67 270 top
C11  90.42,28.37 90 top
C12  97.61,28.07 90 top
C13  91.31,42.42 0 top
C14  99.06,40.51 90 top
C15  44.02,45.87 270 top
C16  50.93,44.45 180 top
C17  31.37,35.56 270 top
C18  33.07,29.39 0 top
C19  42.42,36.07 90 top
C20  43.81,13.84 180 top
C21  61.59,13.84 180 top
C22  61.59,18.41 90 top
C23  79.38,18.41 90 top
C24  57.15,26.04 0 top
C25  94.06,15.98 180 top
C26  53.7,34.16 180 top
C27  12.32,16.41 270 top
C28  62.1,28.19 0 top
C29  19.43,37.34 90 top
C30  6.99,47.02 0 top
C31  11.15,47.22 90 top
C32  116.13,37.85 90 top
C33  6.55,25.2 315 top
C34  19.76,42.8 180 top
C35  4.45,40.61 90 top
C36  20.52,28.4 0 top
C37  6.04,31.95 0 top
D1  108.08,45.47 0 top
D2  24.26,34.29 270 top
IC1  117.47,33.66 0 top
J1  25.5,7.52 90 top
J2  9.63,3.48 0 top
JP1  116.84,43.81 180 top
LED_CLIP  103.38,12.32 180 top
LED_POW  4.95,13.51 0 top
R1  70.99,38.51 0 top
R2  56.01,41.02 270 top
R3  116.81,24.13 90 top
R4  122.89,24.13 90 top
R5  110.74,24.13 90 top
R6  79.25,45.21 0 top
R7  66.67,38.4 180 top
R8  107.77,38.38 270 top
R9  42.8,41.58 180 top
R10  8.48,43.69 0 top
R11  38.73,41.58 180 top
R12  26.42,28.32 180 top
R13  28.57,35.56 270 top
R14  34.04,35.56 270 top
R15  45.47,33.78 270 top
R16  48.9,18.41 270 top
R17  67.31,18.41 270 top
R18  84.45,18.41 270 top
R19  47.93,26.8 180 top
R20  38.86,3.81 0 top
R21  56.64,3.81 0 top
R22  74.42,3.81 0 top
R23  49.4,30.38 270 top
R24  43.81,18.41 90 top
R25  38.73,18.41 90 top
R26  56.52,18.41 90 top
R27  74.3,18.41 90 top
R28  61.59,24.26 270 top
R29  54.86,37.21 0 top
R30  92.2,3.81 0 top
R31  15.27,36.32 180 top
R32  8.64,39.65 0 top
R33  62.36,34.8 90 top
R34  62.36,30.73 180 top
R35  124.13,31.14 270 top
R36  121.03,31.11 90 top
R37  16.26,32.26 90 top
R38  112.01,32.77 270 top
R39  4.45,35.56 90 top
R40  119.79,36.91 180 top
R41  19.43,32.26 90 top
R42  7.62,35.56 90 top
S1  116.59,12.06 270 top
S2  123.57,12.06 270 top
S3  109.6,12.06 270 top
SB1  118.34,20.78 180 top
SB2  124.41,20.78 180 top
SB3  110.69,20.78 180 top
SJ1  38.35,33.91 270 top
SJ2  99.11,12.6 90 top
SJ3  88.87,12.57 270 top
SJ4  55.24,30.1 0 top
SW1  15.11,26.82 270 top
TP+INA1  46.99,23.5 180 top
TPAUDOUTL  38.1,24.77 270 top
TPAUDOUTR  38.1,27.3 90 top
TPCOUT  98.91,22.43 0 top
TPGND  52.7,46.99 180 top
TPOUTA1  49.53,23.5 180 top
TPOUTA2  71.12,26.04 180 top
TPOUTB1  52.07,23.5 180 top
TPVBUS  50.16,46.99 0 top
TPVCOM  88.75,22.43 180 top
TPVINL  68.58,26.04 180 top
TPVINR  91.29,22.43 180 top
TPVOUTL  93.83,22.43 0 top
TPVOUTR  96.37,22.43 180 top
TPVREG  47.62,46.99 0 top
U1  84.45,38.73 0 top
U2  46.99,43.81 0 top
U3  41.91,31.5 270 top
U4  57.78,33.66 0 top
U5  14.68,42.88 90 top
X1  64,45.72 180 top
Y1  103.12,36.58 90 top

### Tracks (layer width: path | path; a pad name or v marks a point on that pad's centre or on a via)
+INA1  (via drill 0.35)
  Top 0.254: U3.1 43.02,32.9 43.03,32.89
  Top 0.305: 33.98,34.25 R14.2 34.8,33.4 | v36.12,32.56 35.63,32.56 34.8,33.4 | 43.03,32.89 44.95,32.89 R15.2 v47.47,32.38 | 34.8,33.4 34.8,29.67 C18.+
  Bottom 0.305: v47.47,32.38 46.69,33.17 39.91,33.17 | 39.91,33.17 36.73,33.17 v36.12,32.56 | TP+INA1.TP 44.3,23.5 39.91,27.89 39.91,33.17
+INA2  (via drill 0.35)
  Top 0.254: U4.1 56.38,34.8 56.39,34.8
  Top 0.305: 56.39,34.8 56.39,37.21 R29.2 56.52,37.47 v57.78,37.47
  Bottom 0.305: v57.78,37.47 64.51,37.47 70.45,31.52 73.52,31.52 74.5,30.54 74.5,30.3 78.76,26.04 99.06,26.04 103.38,21.72 103.38,9.99 R30.2
+INB1
  Top 0.305: SJ1.2 38.61,32.9 U3.5
+INB2
  Top 0.305: U4.5 56.38,30.11 SJ4.2
-INB1  (via drill 0.35)
  Top 0.305: U3.6 40.91,26.48 43.81,23.57 v43.81,21.72 R24.2 | C22.2 61.59,21.29 61.62,21.31 v61.59,21.34 R28.2 | C23.2 v79.38,21.72
  Bottom 0.305: v43.81,21.72 45.24,20.3 60.55,20.3 v61.59,21.34 61.62,21.31 78.97,21.31 v79.38,21.72
-INB2
  Top 0.305: U4.6 59.69,32.66 | 59.69,32.66 61.61,32.66 R33.1 | 59.69,32.66 60.96,31.39 R34.2 60.96,28.49 C28.1
AUDOUTL
  Top 0.305: TPAUDOUTL.TP 37.19,23.85 37.19,21.95 31.07,15.83 13.34,15.83 12.32,14.81 C27.- 12.32,10.79 J2.2
AUDOUTR
  Top 0.305: TPAUDOUTR.TP 38.1,26.72 36.72,25.34 36.72,24.19 36.73,24.18 36.73,22.14 30.91,16.32 10.36,16.32 | 10.36,16.32 7.81,18.86 C33.- | 10.36,16.32 8.89,14.85 8.89,12.06 5.3,8.48 J2.3
CVOUT
  Top 0.305: LED_CLIP.K 102.11,23.29 106.73,27.91 124.83,27.91 125.52,28.61 125.52,33.75 124.31,34.96 IC1.4
  Bottom 0.305: LED_CLIP.K 102.11,19.23 TPCOUT.TP
D+
  Top 0.305: R6.1 77.64,45.21 75.79,43.37 74.3,43.37 74.14,43.37 73.31,43.37 72.96,43.01 | X1.3 72.96,43.01 | R1.1 70.04,40.1 72.96,43.01
D-
  Top 0.305: R7.1 67.62,39.69 66.31,41.01 X1.2
DIN
  Top 0.305: U1.24 88.91,40.36 89.25,40.69 94.8,40.69 98.97,44.86 104.62,44.86 109.48,40.01 120.02,40.01 120.65,40.64 120.65,43.18 119.38,44.45 JP1.3
DOUT
  Top 0.305: U1.25 88.9,41.01 89.06,41.17 94.61,41.17 98.86,45.41 104.95,45.41 109.86,40.51 114.76,40.51 115.72,41.48 115.72,42.95 116.43,43.66 117.53,43.66 118.26,44.4 118.26,45.62 118.87,46.23 121.41,46.23 121.92,45.72 JP1.1
EN  (via drill 0.35)
  Top 0.305: v51.36,26.77 51.33,26.8 R19.1 49.35,28.91 R23.2 | U4.8 59.69,33.66 v60.2,34.16 | U3.8 41.91,29.16 v42.09,28.98
  Bottom 0.305: v60.2,34.16 60.2,33.53 53.44,26.77 v51.36,26.77 46.25,26.77 44.04,28.98 v42.09,28.98
GND  (via drill 0.35)
  other vias: 46.66,19.58 57.71,22.89 64.14,20.07 46.35,16.51 64.24,16.59 46.1,29.21 95.89,44.45 54.89,37.16 24.13,34.29 84.45,36.2 103.89,36.58 52.96,14.1 69.98,14.1 102.82,7.47 63.75,26.04 74.93,39.37 95.2,39.75 109.45,43.36 73.15,38.4 68.58,41.27 46.86,42.27 34.42,43.76 34.04,35.53 81.53,20.42 52.76,19.51 88.9,15.88 73.28,28.68 6.12,41.61 12.06,37.47 43.92,36.83 40.64,43.18
  pour Bottom: 0,0 128,0 128,51 0,51.06
  pour Top: 0,0 128,0 128,51 0,51
MUTE  (via drill 0.35)
  Top 0.305: U1.5 78.59,40.36 v77.09,38.86
  Bottom 0.305: v77.09,38.86 v77.09,38.85 77.78,38.16 79.43,38.16 80.34,39.06 91.95,39.06 105.62,25.4 108.58,25.4 112.32,21.67 112.32,13.55 110.83,12.06 S3.2
N$1
  Top 0.305: R6.2 80.95,44.41 U1.1
N$2
  Top 0.305: U1.2 79.87,42.31 79.7,42.49 75.62,42.49 73.86,40.73 73.86,37.4 73.3,36.83 66.16,36.83 65.72,37.26 R7.2
N$3
  Top 0.305: R32.2 11.18,38.51 11.18,28.22 SW1.2
N$4
  Top 0.305: R18.2 84.45,3.84 R22.3
N$5
  Top 0.305: R27.1 74.3,3.94 R22.1
N$6
  Top 0.305: R3.1 SB1.3
N$7
  Top 0.305: C29.1 R41.2 R37.2 16.26,35.91 R31.1
N$8
  Top 0.305: R5.1 110.74,20.83 SB3.3
N$9
  Top 0.305: SJ2.2 97,15.98 C25.-
N$10
  Top 0.305: R10.1 3.07,43.69 1.87,42.48 1.87,15.33 LED_POW.A
N$11
  Top 0.305: R42.2 7.62,38.54 R32.1 4.88,39.65 C35.1 R39.2
N$12
  Top 0.305: U5.7 14.05,44.12 13.49,43.56 12.01,43.56 10.77,42.32 6.27,42.32 5.43,43.16 3.19,43.16 2.4,42.37 2.4,36.06 4.3,34.16 R39.1 4.45,32.15 C37.1 4.64,27.11 C33.+
N$13
  Top 0.305: R4.1 SB2.3
N$14
  Top 0.305: SB1.2 118.34,11.32 S1.1
N$15
  Top 0.305: R11.1 R9.2
  Top 0.406: U2.2 46.01,43.82 45.49,43.82 44.38,42.71 42.6,42.71 41.85,41.96 R9.2
N$16
  Top 0.305: R12.2 25.02,31.28 24.26,32.04 D2.2 | 24.93,28.32 R12.2 | J1.2 28,24.32 25.02,27.31 R12.2
N$17
  Top 0.305: 28.2,28.7 R12.1 | R13.2 28.07,33.65 28.07,30.35 27.82,30.1 R12.1 | C17.2 31.37,29.43 C18.- 29.6,28.32 R12.1
N$18
  Top 0.305: U1.16 86.59,35.16 86.36,34.92 86.36,32.38 87.97,30.77 C11.+
N$19
  Top 0.305: U1.15 89.3,34.51 90.37,33.44 94.64,33.44 C12.+
N$20
  Top 0.305: SB1.4 115.29,19.56 116.59,18.26 S1.3
N$21
  Top 0.305: SB2.2 124.46,20.73 124.46,18.92 125.27,18.11 125.27,11.27 S2.1
N$22
  Top 0.305: SB2.4 122,20.14 122,19.84 123.58,18.26 123.58,17.27 123.57,17.26 S2.3
N$23
  Top 0.305: SB3.2 112.22,12.18 S3.1
N$24
  Top 0.305: SB3.4 109.17,18.7 109.61,18.26 109.61,17.27 109.6,17.26 S3.3
N$25
  Top 0.305: R21.3 66.64,10.2 C21.1 64.14,13.84 R17.2
N$26
  Top 0.305: R21.1 56.64,10.29 C21.2 59.69,13.84 R26.1
N$27
  Top 0.305: SJ2.1 99.11,6.9 R30.3
N$28
  Top 0.305: R20.3 48.86,10.2 C20.1 45.32,13.84 48.49,17.02 R16.2
N$29
  Top 0.305: R35.1 121.06,32.54 R36.2 120.33,32.06 119.13,30.86 116.97,30.86 116.53,31.3 IC1.1
N$30
  Top 0.305: U5.2 14.05,39.55 15.09,38.51 17.53,38.51 18.41,37.63 20.63,37.63 21.37,36.89 21.37,32.07 20.16,30.86 R41.1 19.87,30.86 21.92,28.8 C36.2
N$31
  Top 0.305: R20.1 38.86,10.29 C20.2 39.24,17.02 R25.1
N$32
  Top 0.305: R24.1 44.09,16.74 44.09,4.04 R20.2
N$33
  Top 0.305: R30.1 88.88,7.14 SJ3.2
N$34
  Top 0.305: R31.2 13.23,35.69 13.23,30.59 15.24,28.57 15.24,26.67 16.36,25.55 SW1.5
N$35
  Top 0.305: C27.+ 14.38,18.19 18.41,22.23 18.41,27.69 C36.1 18.72,28.4 R37.1 14.95,32.16 14.95,35.18 14.97,35.2 14.97,37.45 14.79,37.63 13.97,37.63 12.78,38.82 U5.1
N$36
  Top 0.305: R22.2 79.42,17.52 C23.1
N$37
  Top 0.305: C22.1 61.87,16.74 61.87,4.04 R21.2
N$38
  Top 0.305: R38.2 115.32,33.66 118.11,33.66 118.42,33.34 IC1.3
N$39
  Top 0.305: D1.A 111.38,45.47 JP1.9
N$40
  Top 0.305: C37.2 7.62,32.13 R42.1 8.93,35.47 8.93,40.78 9.1,40.95 10.78,40.95 11.99,42.16 13.59,42.16 15.32,43.89 U5.6
N$42
  Top 0.305: R40.1 120.81,36.83 123.14,36.83 125.97,33.99 125.97,28.31 125.12,27.46 106.93,27.46 104.65,25.17 LED_CLIP.A
N$45
  Top 0.305: C24.2 60.45,26.04 60.83,25.66 R28.1
OUTA1
  Top 0.305: 83.82,19.27 R18.1 84.45,22.18 83.62,23.01 70.51,23.01 R17.1 63.16,23.96 53.56,23.96 52.64,24.88 51.5,24.88 50.11,23.5 TPOUTA1.TP | U3.9 U3.10 46.74,30.1 48.2,28.64 48.2,25.82 49.53,24.49 TPOUTA1.TP | TPOUTA1.TP 48.9,22.86 R16.1
OUTA2  (via drill 0.35)
  Top 0.305: U4.9 U4.10 59.63,34.66 61.18,36.2 R33.2 62.41,35.81 v64.26,35.81
  Bottom 0.305: v64.26,35.81 65.58,34.49 65.58,31.57 TPOUTA2.TP 71.14,26.06
OUTB1
  Top 0.305: C25.+ 92.19,16.24 90.31,18.13 77.41,18.13 75.72,19.82 R27.2 73.19,18.71 58.12,18.71 57.02,19.82 R26.2 | 44.94,18.71 45.12,18.89 45.12,20.74 44.5,21.36 44.5,23.54 41.41,26.62 U3.7 | R25.2 39.84,18.71 44.94,18.71 | 44.94,18.71 55.41,18.71 R26.2 | R26.2 52.84,23.5 TPOUTB1.TP
OUTB2
  Top 0.305: SJ3.1 88.95,13.92 93.02,13.92 94.19,15.09 94.19,19.51 | 94.19,19.51 99.52,19.51 101.6,21.59 101.6,23.43 106.54,28.37 123.85,28.37 124.13,28.65 R35.2 | 94.19,19.51 87.78,19.51 83.82,23.47 68.15,23.47 63.5,28.11 C28.2 63.5,30.48 R34.1 | U4.7 60.25,33.16 60.98,33.89 60.98,34.53 61.13,34.67 63.41,34.67 63.76,34.31 R34.1 | C1.- 67.91,32.64 67.95,32.64 66.04,30.73 | TPVINL.TP 68.58,28.19 66.04,30.73 | R34.1 66.04,30.73
  Bottom 0.305: SW1.1 SW1.4 18.41,26.06 18.41,15.81 21.07,13.16 29.03,13.16 38.27,22.4 44.1,22.4 44.5,22 44.5,21.97 45.72,20.75 60.05,20.75 61.31,22.02 64.56,22.02 TPVINL.TP
SEL0
  Top 0.305: U1.8 81.98,38.41 83.52,39.95 83.52,45.72 85.35,47.55 114.33,47.55 116.79,45.09 JP1.5
SEL1
  Top 0.305: U1.9 82.11,37.76 84.05,39.7 84.05,45.55 85.52,47.02 112.37,47.02 JP1.7
SSPND  (via drill 0.35)
  Top 0.305: U1.28 v86.27,42.96 v86.26,42.95 | v110.47,26.7 110.47,25.39 R5.2 110.8,25.05 116.71,25.05 R3.2 R4.2 | v47.95,41.91 v47.97,41.92 U2.4
  Bottom 0.305: v110.47,26.7 110.39,26.77 106.2,26.77 90.02,42.95 v86.26,42.95 76.2,42.95 72.82,39.57 55.04,39.57 52.7,41.91 v47.95,41.91
VBUS
  Top 0.305: 49.96,44.47 C16.2
  Top 0.406: 50.09,43.18 54.76,43.18 R2.1 56.27,41.72 62.04,41.72 X1.1 | C3.1 49.98,43.07 50.09,43.18 | 50.09,43.18 49.98,43.29 C16.2 49.98,46.8 TPVBUS.TP | U2.6 49.96,44.47
VBUS*
  Top 0.406: R2.2 56.59,39.49 62.33,39.49 65.5,36.32 73.51,36.32 78.47,41.29 C4.1 78.7,41.66 U1.3
VCCCI
  Top 0.305: U1.10 82.19,37.11 84.58,39.5 84.58,45.38 85.69,46.48 105.41,46.48 106.43,45.47 D1.C
  Top 0.406: U1.10 78.39,37.11 C6.+
VCCP1I
  Top 0.305: U1.17 88.92,35.81 90.17,34.56 90.17,34.49 C7.1
VCCP2I
  Top 0.305: U1.19 89.12,37.11 89.7,36.52 C8.1
VCCXI
  Top 0.305: U1.23 90.37,39.71 C9.1
VCOM  (via drill 0.35)
  Top 0.406: v75.18,30.58 76.02,29.74 C5.+ 77.29,29.74 | C24.1 55.75,27.04 53.98,28.82 SJ4.1 53.44,29.57 53.37,29.57 v52.32,30.61 | v53.85,39.34 53.46,38.96 R29.1 v51.82,37.21 48.13,37.21 46.1,35.18 R15.1 45.47,36.46 43.9,38.03 41.14,38.03 38.35,35.24 SJ1.1 | TPVCOM.TP 87.88,23.29 86.33,23.29 84.94,24.69 82.35,24.69 77.29,29.74 | 77.29,29.74 77.34,29.74 76.81,30.28 76.81,31 80.31,34.51 U1.14 | U5.3 15.32,42.16 15.95,42.8 17.22,42.8 | 17.22,42.8 18.49,42.8 | 18.49,42.8 C34.2 | U5.5 16.59,43.43 17.22,42.8 | v18.8,44.27 18.8,43.1 18.49,42.8
  Bottom 0.406: v75.18,30.58 73.73,32.03 70.66,32.03 63.63,39.06 53.85,39.06 v53.85,39.34 52.85,40.34 22.73,40.34 v18.8,44.27 | v52.32,30.61 51.82,31.11 v51.82,37.21
VDD  (via drill 0.35)
  Top 0.305: U1.27 90.27,42.31 C13.1 90.39,42.76 91.82,44.2 | 91.82,44.2 v90.17,44.2 | JP1.8 114.3,42.42 112.9,41.02 110.11,41.02 105.18,45.95 93.57,45.95 91.82,44.2 | R1.2 71.94,40.22 73.64,41.91 v73.66,41.91
  Bottom 0.305: v90.17,44.2 76.71,44.2 74.42,41.91 v73.66,41.91 | JP1.8 JP1.6
VINL
  Top 0.305: U1.12 79.73,35.81 76.26,32.34 72.97,32.34 C1.+
VINR
  Top 0.305: 83.19,26.1 C2.- 83.19,25.4 83.39,25.2 85.15,25.2 86.53,23.81 89.32,23.81 90.7,22.43 TPVINR.TP
VINR*
  Top 0.305: U1.13 82.02,35.16 83.19,33.99 C2.+
VOLD  (via drill 0.35)
  Top 0.305: U1.7 79.32,39.06 v79.12,38.86
  Bottom 0.305: v79.12,38.86 79.81,39.55 92.12,39.55 105.81,25.86 108.82,25.86 112.78,21.9 112.78,13.38 114.09,12.06 S1.2
VOLU  (via drill 0.35)
  Top 0.305: U1.6 78.72,39.71 78.11,39.1 v78.11,38.84
  Bottom 0.305: v78.11,38.84 79.27,40.01 92.31,40.01 106,26.31 109.02,26.31 113.28,22.05 113.28,14.66 114.41,13.53 122.11,13.53 S2.2
VOUTL
  Top 0.305: C11.- 90.77,26.12 93.83,23.06 TPVOUTL.TP
  Bottom 0.305: TPVOUTL.TP 84.1,12.7 20.88,12.7 16.38,17.2 SW1.6
VOUTR
  Top 0.305: C12.- 96.37,24.42 TPVOUTR.TP
  Bottom 0.305: TPVOUTR.TP 94.98,21.04 93.09,21.04 84.29,12.24 20.68,12.24 13.84,19.07 SW1.3
VREG
  Top 0.406: U4.2 C26.1 53.75,35.06 53.53,35.28 49.76,35.28 48.49,34.01 48.26,34.01 | 42.49,34.58 43.01,34.58 43.59,34.01 48.26,34.01 | 42.49,34.58 C19.1 40.95,33.65 36.97,33.65 36.1,34.52 36.1,38.23 34.33,40.01 | C32.1 118.84,36.9 R40.2 | 34.33,40.01 26.81,47.52 12.85,47.52 11.45,46.12 11.3,46.12 C31.1 | U3.2 42.41,34.5 42.49,34.58 | TPVREG.TP 46.02,45.38 U2.1 44.48,44.47 C15.2 43.56,44.47 39.21,44.47 37.78,43.04 R11.2 35.9,41.58 34.33,40.01 | U5.8 12.75,45.31 12.11,45.31 C31.1 | R10.2 9.47,43.73 9.47,46.13 C30.+ 9.33,46.27 C31.1 | C32.1 116.13,35.36 IC1.5 | C32.1 115.42,36.9 109.47,30.95 R38.3 | 48.26,34.01 49.4,32.87 R23.1
  Bottom 0.406: TPVREG.TP 47.62,47.91 48.26,48.54 77.13,48.54 78.76,46.91 91.58,46.91 95.95,42.55 JP1.10 111.76,32.59 R38.3
XTI
  Top 0.305: R8.1 105.72,41.33 Y1.2 103.09,41.36 C14.2 98.33,41.46 95.28,38.41 U1.21
XTO
  Top 0.305: R8.2 103.12,32.9 Y1.1 101.22,33.73 C10.2 97.85,33.72 95.89,35.69 95.89,36.2 94.32,37.76 U1.20

### Text on the board
tPlace: Digital Audio / Interface V1.1 / William Losin / 2025-09-17 | BASS | MID | TREBLE